# Altium schematic sheet Connectors.SchDoc
size A; SheetNumber: 4; SheetTotal: 6
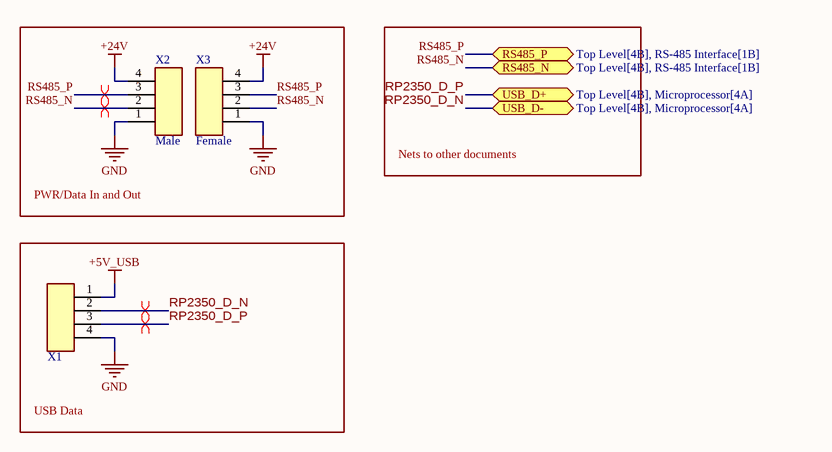
[diagram p0: Connectors.SchDoc]

## Parts
X1  [Sherlock] 4pin  [[Sherlock] 4pin]  (value not drawn)
X2  Male  [[Pogo] Magnetic Right-Angle 4pos Male]
X3  Female  [[Pogo] Magnetic Right-Angle 4pos Female]

## Blocks framed on the sheet
PWR/Data In and Out: X2 X3
USB Data: X1

## Ports
RS485_N (bidir, see Top Level[4B], RS-485 Interface[1B]), RS485_P (bidir, see Top Level[4B], RS-485 Interface[1B]), USB_D+ (bidir, see Top Level[4B], Microprocessor[4A]), USB_D- (bidir, see Top Level[4B], Microprocessor[4A])

## Nets
+5V_USB: X1.1
+24V: X2.4 X3.4
GND: X1.4 X2.1 X3.1
RP2350_D_N: X1.2 ; port USB_D-
RP2350_D_P: X1.3 ; port USB_D+
RS485_N: X2.2 X3.2 ; port RS485_N
RS485_P: X2.3 X3.3 ; port RS485_P

## Layout directives
differential pair; differential pair class USB_Pairs: RP2350_D_N, RP2350_D_P
differential pair; differential pair class RS485_Pairs: RS485_N, RS485_P

## Notes on the sheet
- Nets to other documents

## Library data of the parts
X1 = [Sherlock] 4pin: 0353620450; Supplier 1: DigiKey; Supplier Part Number 1: WM18922-ND
X2 = [Pogo] Magnetic Right-Angle 4pos Male: 5358; Supplier 1: DigiKey; Supplier Part Number 1: 1528-5358-ND
X3 = [Pogo] Magnetic Right-Angle 4pos Female: 5358; Supplier 1: DigiKey; Supplier Part Number 1: 1528-5358-ND